# Altium schematic sheet log.SchDoc: DiPho AFE
size 420 x 297 mm; DrawnBy: P. Daniel; Address1: WUT ISE; Address3: piotrmaciejdaniel@gmail.com; SheetNumber: 3; SheetTotal: 4; ModifiedBy: -; CreateDate: 10-12.2021; CheckedDate: -; Title2: log amp schematic; DivGrp: WUT ISE; Designer: Piotr Daniel
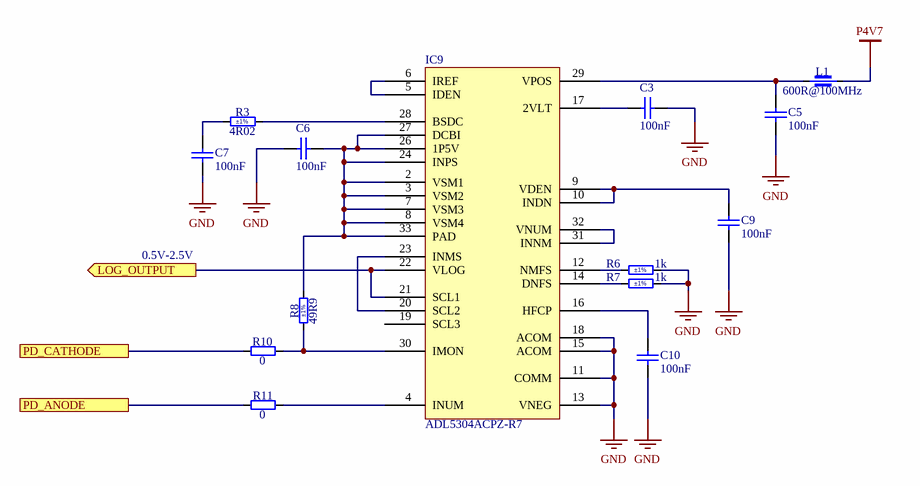
[diagram p0: log.SchDoc]

## Parts
C3  100nF  [CAPC1005X55N]
C5  100nF  [CAPC1005X55N]
C6  100nF  [CAPC1005X55N]
C7  100nF  [CAPC1005X55N]
C9  100nF  [CAPC1005X55N]
C10  100nF  [CAPC1005X55N]
IC9  ADL5304ACPZ-R7  [LFCSP32]
L1  600R@100MHz  [INDC1005X55N]
R3  4R02  Tolerance: ±1%  [RESC1005X40N]
R6  1k  Tolerance: ±1%  [RESC1005X40N]
R7  1k  Tolerance: ±1%  [RESC1005X40N]
R8  49R9  Tolerance: ±1%  [RESC1005X40N]
R10  0  [RESC1005X40N]
R11  0  [RESC1005X40N]

## Ports
LOG_OUTPUT (out), PD_ANODE, PD_CATHODE

## Nets
GND: C3.1 C5.1 C6.2 C7.2 C9.1 C10.1 IC9.11(COMM) IC9.13(VNEG) IC9.15(ACOM) IC9.18(ACOM) R6.2 R7.2
P4V7: L1.2
LOG_OUTPUT: IC9.21(SCL1) IC9.22(VLOG) ; port LOG_OUTPUT
PD_ANODE: R11.1 ; port PD_ANODE
PD_CATHODE: R10.1 ; port PD_CATHODE
NetC3_2: C3.2 IC9.17(2VLT)
NetC5_2: C5.2 IC9.29(VPOS) L1.1
NetC6_1: C6.1 IC9.2(VSM1) IC9.3(VSM2) IC9.7(VSM3) IC9.8(VSM4) IC9.24(INPS) IC9.26(1P5V) IC9.27(DCBI) IC9.33(PAD) R8.2
NetC7_1: C7.1 R3.1
NetC9_2: C9.2 IC9.9(VDEN) IC9.10(INDN)
NetC10_2: C10.2 IC9.16(HFCP)
NetIC9_4: IC9.4(INUM) R11.2
NetIC9_5: IC9.5(IDEN) IC9.6(IREF)
NetIC9_12: IC9.12(NMFS) R6.1
NetIC9_14: IC9.14(DNFS) R7.1
NetIC9_20: IC9.20(SCL2) IC9.23(INMS)
NetIC9_28: IC9.28(BSDC) R3.2
NetIC9_30: IC9.30(IMON) R8.1 R10.2
NetIC9_31: IC9.31(INNM) IC9.32(VNUM)

Not connected (* = marked no-connect by the designer): IC9 19(SCL3)

## Notes on the sheet
- 0.5V-2.5V
- Project/Equipment
- Document
- Designer
- Drawn by
- Check.by
- Copyright WUT ISE 2021.
  This documentation describes Open Hardware and is licensed under the CERN OHL v.1.1. You may redistribute and modify this documentation under the terms of the CERN OHL v.1.1. (http://ohwr.org/CERNOHL). This documentation is distributed WITHOUT ANY EXPRESS OR IMPLIED WARRANTY, INCLUDING OF MERCHANTABILITY, SATISFACTORY QUALITY AND FITNESS FOR A PARTICULAR PURPOSE. Please see the CERN OHL v.1.1 for applicable conditions.
- Contact
- File
- Last Mod.
- Print Date
- Sheet
- Size
- A3
- of
- Rev

## Library data of the parts
C3 C5-C7 C9 C10 = CC0402_100NF_16V_10%_X7R: Non-polarised capacitor; Manufacturer: GENERIC; Part Description: SMD Multilayer Chip Ceramic Capacitor; Manufacturer1 Part Number: GRM155R71C104KA88D; Tolerance: ±10%; Voltage: 16V; TC: X7R; Part Number: CC0402_100NF_16V_10%_X7R; Component Kind: Standard; Component Type: Standard; Pin Count: 2; Value: 100nF; Status: Not Recommended; Manufacturer Part Number: CC0402_100NF_16V_10%_X7R; Case: 0402; Mounted: Yes; Socket: No; SMD: Yes; Sense: No; Manufacturer1 Example: MURATA; Manufacturer1 ComponentHeight: 0.55mm; HelpURL: \\cern.ch\dfs\Applications\Altium\Datasheets\CC0402_X7R_MURATA_GRM.pdf; Author: CERN DEM JLC; CreateDate: 05.12.2013; LatestRevisionDate: 03.12.2007
IC9 = ADL5304ACPZ-R7: SP Amp LOG Amp Single 5.5V 32-Pin LFCSP EP T/R; Manufacturer: Analog Devices; Min Supply Voltage: 4.5V; Operating Supply Current: 20.8mA; Number of Channels: 1; Operating Supply Voltage: 5V; -3db Bandwidth: 4MHz; Max Power Dissipation: 600mW; Number of Elements: 3; Input Offset Voltage (Vos): 600mV; Linearity: 2%; Supplier 1: Digi-Key; Manufacturer Part Number: ADL5304ACPZ-R7; RoHS: Yes; Category: Amplifiers - Op Amps, Buffer, Instrumentation; Stock 1: 3298; Pricing 1: 1=21,42000, 10=19,75500, 25=18,86680, 100=16,86930, 250=16,09240, 500=15,70500 (USD); Mount: Surface Mount; Case/Package: LFCSP EP; Number of Pins: 32; Contact Plating: Tin,Matte; Min Operating Temperature: -40°C; Max Operating Temperature: 85°C; Max Supply Voltage: 5.5V; Packaging: Tape and Reel; Package Quantity: 1; Power Dissipation: 600mW; Number of Amplifiers: 3; Series: -; Lead Free: Contains Lead; RoHS Compliant: Yes; REACH SVHC: No SVHC; ComponentLink1URL: https://datasheet.ciiva.com/1823/adl5304-1823090.pdf?src-supplier=Digi-Key; ComponentLink1Description: https://datasheet.ciiva.com/1823/adl5304-1823090.pdf?src-supplier=Digi-Key; ComponentLink2URL: https://datasheet.ciiva.com/1823/adl5304-1823091.pdf?src-supplier=Digi-Key; ComponentLink2Description: https://datasheet.ciiva.com/1823/adl5304-1823091.pdf?src-supplier=Digi-Key; ComponentLink3URL: https://datasheet.ciiva.com/2965/adl5304-2965478.pdf?src-supplier=Avnet; ComponentLink3Description: https://datasheet.ciiva.com/2965/adl5304-2965478.pdf?src-supplier=Avnet; ComponentLink4URL: https://datasheet.ciiva.com/46392/1501172-46392079.pdf?src-supplier=Element14; ComponentLink4Description: https://datasheet.ciiva.com/46392/1501172-46392079.pdf?src-supplier=Element14; ComponentLink5URL: https://datasheet.ciiva.com/1823/adl5304-1823092.pdf?src-supplier=Digi-Key; ComponentLink5Description: https://datasheet.ciiva.com/1823/adl5304-1823092.pdf?src-supplier=Digi-Key; ComponentLink6URL: https://datasheet.ciiva.com/17372/adl5304-17372079.pdf?src-supplier=Avnet+Europe; ComponentLink6Description: https://datasheet.ciiva.com/17372/adl5304-17372079.pdf?src-supplier=Avnet+Europe; Supplier Part Number 1: ADL5304ACPZ-R7CT-ND
L1 = IND0402_MURATA_BLM15HD601SN1: Part Description: SMD EMIFIL Suppression Chip Ferrite Bead; Manufacturer: MURATA; Manufacturer Part Number: BLM15HD601SN1D; Power: 300mA; Resistance: 0.85R; Tolerance: ±25%; Part Number: IND0402_MURATA_BLM15HD601SN1; Component Kind: Standard; Component Type: Standard; Pin Count: 2; Value: 600R@100MHz; Status: None; Case: 0402; Mounted: Yes; Socket: No; SMD: Yes; Sense: No; ComponentHeight: 0.55mm; HelpURL: \\cern.ch\dfs\Applications\Altium\Datasheets\IND0402_MURATA_BLM15H.pdf; Author: CERN DEM JLC; CreateDate: 28.02.2012; LatestRevisionDate: 25.10.2018
R3 = R0402_4R02_1%_0.063W_100PPM: Resistor - 1%; Part Description: General Purpose Thick Film Chip Resistor; Manufacturer: GENERIC; Manufacturer1 Part Number: CRCW04024R02FK; Power: 0.063W; TC: ±100ppm/°C; PressFit: No; Part Number: R0402_4R02_1%_0.063W_100PPM; Component Kind: Standard; Component Type: Standard; Pin Count: 2; Value: 4R02; Status: None; Manufacturer Part Number: R0402_4R02_1%_0.063W_100PPM; Case: 0402; Mounted: Yes; Sense: No; Socket: No; SMD: Yes; Manufacturer1 Example: VISHAY; Manufacturer1 ComponentHeight: 0.4mm; HelpURL: \\cern.ch\dfs\Applications\Altium\Datasheets\R0402_VISHAY_CRCW e3.pdf; Author: CERN DEM BC; CreateDate: 18.11.2020; LatestRevisionDate: 18.11.2020
R6 R7 = R0402_1K_1%_0.0625W_100PPM: Resistor - 1%; Part Description: General Purpose Thick Film Chip Resistor; Manufacturer: GENERIC; Manufacturer1 Part Number: 232270671002L; TC: ±100ppm/°C; PressFit: No; Part Number: R0402_1K_1%_0.0625W_100PPM; Component Kind: Standard; Component Type: Standard; Pin Count: 2; Value: 1k; Status: Not Recommended; Power: 0.0625W; Manufacturer Part Number: R0402_1K_1%_0.0625W_100PPM; Case: 0402; Mounted: Yes; Sense: No; Socket: No; SMD: Yes; Manufacturer1 Example: YAGEO PHYCOMP; Manufacturer1 ComponentHeight: 0.4mm; HelpURL: \\cern.ch\dfs\Applications\Altium\Datasheets\R0402_Phycomp_RC0402.pdf; Author: CERN DEM JLC; CreateDate: 03.12.2007; LatestRevisionDate: 17.10.2012
R8 = R0402_49R9_1%_0.0625W_100PPM: Resistor - 1%; Part Description: General Purpose Thick Film Chip Resistor; Manufacturer: GENERIC; Manufacturer1 Part Number: 232270674999L or RC0402FR-0749R9L; TC: ±100ppm/°C; PressFit: No; Part Number: R0402_49R9_1%_0.0625W_100PPM; Component Kind: Standard; Component Type: Standard; Pin Count: 2; Value: 49R9; Status: Not Recommended; Power: 0.0625W; Manufacturer Part Number: R0402_49R9_1%_0.0625W_100PPM; Case: 0402; Mounted: Yes; Sense: No; Socket: No; SMD: Yes; Manufacturer1 Example: YAGEO PHYCOMP; Manufacturer1 ComponentHeight: 0.4mm; HelpURL: \\cern.ch\dfs\Applications\Altium\Datasheets\R0402_Phycomp_RC0402.pdf; Author: CERN DEM JLC; CreateDate: 24.10.2012; LatestRevisionDate: 24.10.2012
R10 R11 = R0402_0R_JUMPER: Resistor; Part Description: 1A (0.05R Max DC Resistance) Zero Ohm Jumper; Manufacturer: GENERIC; Manufacturer1 Part Number: 232270591001L; PressFit: No; Part Number: R0402_0R_JUMPER; Component Kind: Standard; Component Type: Standard; Pin Count: 2; Value: 0; Status: Not Recommended; Manufacturer Part Number: R0402_0R_JUMPER; Case: 0402; Mounted: Yes; Sense: No; Socket: No; SMD: Yes; Manufacturer1 Example: YAGEO PHYCOMP; Manufacturer1 ComponentHeight: 0.4mm; HelpURL: \\cern.ch\dfs\Applications\Altium\Datasheets\R0402_Phycomp_RC0402.pdf; Author: CERN DEM JLC; CreateDate: 03.12.2007; LatestRevisionDate: 17.10.2012